# EasyEDA Pro project codeday-badge.eprj, board CodeDay Badge Programmer
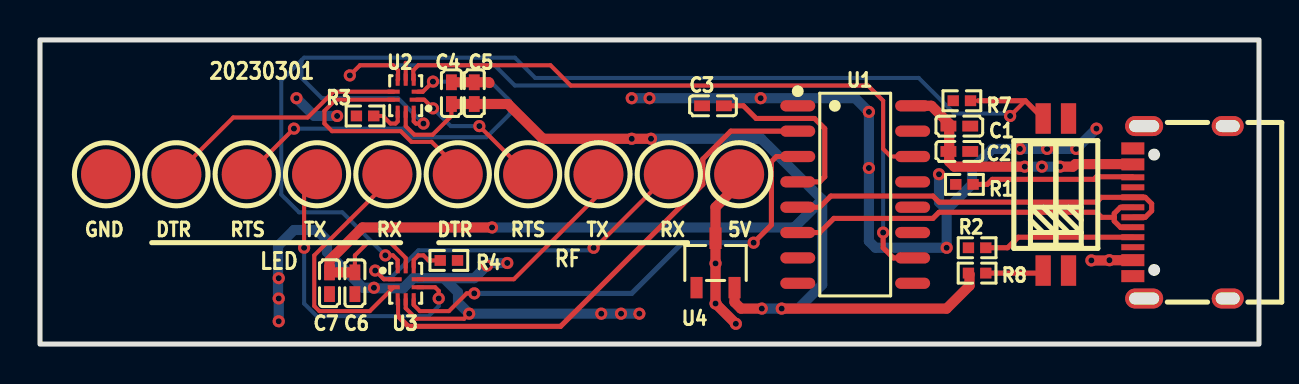
[diagram p6: board, top side]
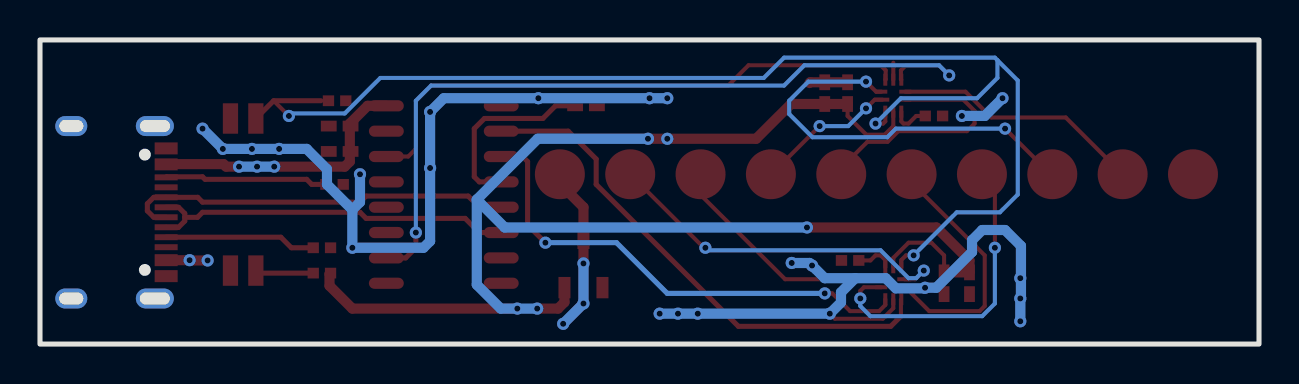
[diagram p7: board, bottom side, seen from below]

Outline 60.96 x 15.24 mm; copper layers: Top Layer, Bottom Layer. Coordinates in mm from the lower left corner of the outline.
Outline path: rectangle 0,15.24 60.96,0
Stack: Top Layer 0.035mm / Dielectric1 1.51mm FR4 er 4.5 / Bottom Layer 0.035mm

## Design rules (mm)
spacing safeClearance (default): track to track 0.152, other pairs 0.152 to 0.3
track width trackWidth (default): min 0.127, default 0.254, max 2.54
track width trackWidthPwr: min 0.127, default 0.508, max 2.54
differential pair differentialPair (default): width min 0.127, default 0.254, max 2.54; gap min 0.152, default 0.152
via viaSize (default): diameter min 0.5, default 0.61, max 10; hole min 0.3, default 0.305, max 6
net +5V uses trackWidthPwr
net VCC uses trackWidthPwr

## Placement (name value [footprint] x y rotation side)
5V  KH-205580-DZ  [SMD_BD2.0-L2.0-W2.0_C9900001905]  34.96 8.51 270 top
C1  10uF  [C0402]  45.97 10.92 180 top
C2  100nF  [C0402_NEW]  45.97 9.65 180 top
C3  10uF  [C0402]  33.65 11.94 180 top
C4  10uF  [C0402]  20.57 12.57 270 top
C5  100nF  [C0402_NEW]  21.72 12.57 270 top
C6  10uF  [C0402]  15.75 3.05 90 top
C7  100nF  [C0402_NEW]  14.48 3.05 90 top
DTR  -  [SMD_BD2.0-L2.0-W2.0_C9900001905]  20.89 8.51 270 top
DTR#2  -  [SMD_BD2.0-L2.0-W2.0_C9900001905]  6.82 8.51 270 top
GND  KH-205580-DZ  [SMD_BD2.0-L2.0-W2.0_C9900001905]  3.3 8.51 270 top
R1  5.1kΩ  [R0402]  46.23 8 180 top
R2  5.1kΩ  [R0402]  46.86 4.83 180 top
R3  5.1kΩ  [R0402]  16.26 11.43 180 top
R4  5.1kΩ  [R0402]  20.45 4.19 0 top
R7  10kΩ  [R0402]  46.1 12.19 180 top
R8  2kΩ  [R0402]  46.86 3.56 180 top
RTS  -  [SMD_BD2.0-L2.0-W2.0_C9900001905]  24.41 8.51 270 top
RTS#2  -  [SMD_BD2.0-L2.0-W2.0_C9900001905]  10.34 8.51 270 top
RX  -  [SMD_BD2.0-L2.0-W2.0_C9900001905]  17.37 8.51 270 top
RX#2  -  [SMD_BD2.0-L2.0-W2.0_C9900001905]  31.44 8.51 270 top
SW1  DSHP02TSGET  [SW-SMD_4P_DSHP02TSGET]  50.8 7.49 0 top
TX  -  [SMD_BD2.0-L2.0-W2.0_C9900001905]  27.93 8.51 270 top
TX#2  -  [SMD_BD2.0-L2.0-W2.0_C9900001905]  13.86 8.51 270 top
U1  CH340C  [SOP-16_L10.0-W3.9-P1.27-LS6.0-BL]  40.77 7.49 270 top
U2  TS3USB30ERSWR  [UQFN-10_L1.8-W1.4-P0.40-TL]  18.29 12.45 180 top
U3  TS3USB30ERSWR  [UQFN-10_L1.8-W1.4-P0.40-TL]  18.29 3.05 0 top
U4  XC6206P332MR  [SOT-23-3_L2.9-W1.6-P1.90-LS2.8-BR]  33.78 4.06 270 top
USB1  GT-USB-7010C  [USB-C-SMD_GT-USB-7010C]  57.02 6.6 90 top

## Footprints (pads in the part's own frame, mm; a bottom-side part is the same pattern mirrored in y, then rotated)
C0402
  rect 0.79x0.54 smd: 1(-0.545,0) 2(0.545,0)
C0402_NEW
  rect 0.79x0.54 smd: 1(-0.545,0) 2(0.545,0)
R0402
  rect 0.566x0.54 smd: 1(-0.433,0) 2(0.433,0)
SMD_BD2.0-L2.0-W2.0_C9900001905
  round 2.5 smd: 1(0,0)
SOP-16_L10.0-W3.9-P1.27-LS6.0-BL
  oval 0.56x1.745 smd: 1(-4.445,-2.873) 2(-3.175,-2.873) 3(-1.905,-2.873) 4(-0.635,-2.873) 5(0.635,-2.873) 6(1.905,-2.873) 7(3.175,-2.873) 8(4.445,-2.873) 9(4.445,2.873) 10(3.175,2.873) 11(1.905,2.873) 12(0.635,2.873) 13(-0.635,2.873) 14(-1.905,2.873) 15(-3.175,2.873) 16(-4.445,2.873)
SOT-23-3_L2.9-W1.6-P1.90-LS2.8-BR
  rect 1.07x0.6 smd: 1(1.235,-0.95) 2(1.235,0.95) 3(-1.235,0)
SW-SMD_4P_DSHP02TSGET
  rect 0.762x1.524 smd: 1(-0.635,-3.81) 2(0.635,-3.81) 3(0.635,3.81) 4(-0.635,3.81)
UQFN-10_L1.8-W1.4-P0.40-TL
  rect 0.7x0.2 smd: 1(-0.55,0.2)
  rect 0.6x0.2 smd: 2(-0.6,-0.2) 6(0.6,-0.2) 7(0.6,0.2)
  rect 0.2x0.6 smd: 3(-0.4,-0.8) 4(0,-0.8) 5(0.4,-0.8) 8(0.4,0.8) 9(0,0.8) 10(-0.4,0.8)
USB-C-SMD_GT-USB-7010C
  oval 1x1.9 hole 0.6x1.5: 1(-4.32,1.808) 2(4.32,1.808)
  oval 1x1.6 hole 0.6x1.2: 3(4.32,-2.373) 4(-4.32,-2.373)
  rect 0.6x1.15 smd: A1B12(-3.2,2.373) A4B9(-2.4,2.373) B1A12(3.2,2.373) B4A9(2.4,2.373)
  rect 0.3x1.15 smd: A5(-1.25,2.373) A6(-0.25,2.373) A7(0.25,2.373) A8(1.25,2.373) B5(1.75,2.373) B6(0.75,2.373) B7(-0.75,2.373) B8(-1.75,2.373)

## Nets
+5V: 5V.1 C1.2 C2.2 U1.16 U4.3 USB1.A4B9 USB1.B4A9
GND: C1.1 C2.1 C3.2 C4.1 C5.1 C6.1 C7.1 GND.1 R1.2 R2.2 R3.2 R4.2 R7.2 U1.1 U2.4 U3.4 U4.1 USB1.1 USB1.2 USB1.3 USB1.4 USB1.A1B12 USB1.B1A12
VCC: C4.2 C5.2 C6.2 C7.2 R8.2 U2.9 U3.9 U4.2
DN: U1.6 USB1.A7 USB1.B7
DP: U1.5 USB1.A6 USB1.B6
DTR: U1.10 U2.5
DTR_LED: DTR#2.1 U2.6
DTR_RF: DTR.1 U2.7
RTS: U1.14 U2.3
RTS_LED: RTS#2.1 U2.2
RTS_RF: RTS.1 U2.1
RX: U1.3 U3.5
RX_LED: RX.1 U3.2
RX_RF: RX#2.1 U3.1
S: R7.1 SW1.4 U2.10 U3.10
TX: U1.2 U3.3
TX_LED: TX#2.1 U3.6
TX_RF: TX.1 U3.7
$1N2326: R1.1 USB1.B5
$1N2338: R2.1 USB1.A5
$1N2857: C3.1 U1.4
$1N5374: R3.1 U2.8
$1N5478: R4.1 U3.8
$1N7631: R8.1 SW1.1

Pads without a net: SW1 2 3; U1 7 8 9 11 12 13 15; USB1 A8 B8

## Via types
v1: diameter 0.61, hole 0.305, Top Layer to Bottom Layer, 51 vias

## Routing (per net, layer and track width the routed paths; a pad name or vN(x,y) marks a point on that pad's centre or on a via; arc(x,y) is an arc through that point)
+5V: length 27.3
  Top Layer w0.508: v1(49.25,8.89) 45.72,8.89 45.47,9.14 45.47,9.61 ; 45.47,10.88 45.43,10.92 ; 45.47,10.88 45.47,11.05 44.58,11.94 U1.16 ; 45.47,10.88 45.47,9.61 ; 34.67,1.14 v1(33.78,2.03) v1(33.78,4.04) U4.3 33.78,6.86 34.96,8.04 5V.1 ; USB1.B4A9 54.64,9.02 51.78,9.02 51.65,8.89 v1(51.01,8.89) ; USB1.A4B9 v1(53.48,4.2) 53.46,4.19 v1(52.58,4.19) ; 45.47,9.61 45.43,9.65
  Bottom Layer w0.508: v1(49.25,8.89) v1(50.11,8.89) v1(51.01,8.89) ; v1(33.78,4.04) v1(33.78,2.03) v1(34.8,1.02)
GND: length 73.7
  Top Layer w0.203: v1(21.46,1.52) 21.21,1.27 18.81,1.27 18.29,1.8 U3.4 ; U2.4 18.29,14.1
  Top Layer w0.508: 22.48,13.08 22.44,13.12 C5.1 C4.1
  Bottom Layer w0.508: 45.34,6.73 44.96,7.11 v1(44.96,8.51) ; 45.34,6.73 v1(45.34,4.83) 41.78,4.83 41.45,5.16 v1(41.45,8.82) v1(41.45,11.63) 40.77,12.32 v1(36.04,12.32) v1(30.48,12.32) v1(29.59,12.32) ; 45.34,6.73 46.61,8 46.61,8.76 47.62,9.78 v1(49,9.78) v1(50.36,9.78) v1(51.82,9.78) v1(52.83,10.8) ; v1(29.97,1.52) v1(29.06,1.52) v1(28.07,1.52) v1(21.46,1.52) 20.9,2.08 20.9,2.59 20.19,3.3 ; 20.19,3.3 18.67,3.3 18.16,2.79 16.73,2.79 v1(16.7,2.82) 16.14,2.82 14.35,4.61 14.35,5.21 13.84,5.71 12.7,5.71 11.9,4.92 11.9,2.32 v1(11.94,2.29) v1(11.94,1.14) ; 20.19,3.3 21.72,3.3 v1(22.35,3.94) 22.48,4.06 v1(23.37,4.06) ; v1(12.83,12.32) 13.72,11.43 v1(14.86,11.43)
  vias: v1(11.94,3.3)
VCC: length 77.4
  Top Layer w0.203: C6.2 15.75,4.44 16.38,5.08 17.53,5.08 18.29,4.32 U3.9 ; C4.2 20.57,11.43 19.63,10.49 18.72,10.49 18.29,10.92 U2.9
  Top Layer w0.508: v1(36.1,1.78) 35.05,1.78 34.73,2.1 U4.2 ; v1(37.09,1.78) 45.34,1.78 46.48,2.92 46.48,3.5 R8.2 ; C6.2 C7.2 14.48,4.19 16.13,5.84 v1(22.61,5.84) ; C4.2 C5.2 23.4,12.03 25.15,10.29 v1(29.59,10.29) v1(30.56,10.29)
  Bottom Layer w0.508: v1(36.1,1.78) v1(37.09,1.78) 37.92,1.78 39.12,2.98 39.12,7.24 ; 39.12,7.24 37.72,5.84 v1(22.61,5.84) ; 39.12,7.24 36.07,10.29 v1(30.56,10.29)
DN: length 18.9
  Top Layer w0.254: U1.6 38.99,5.59 39.7,6.3 44.65,6.3 44.96,6.6 52.83,6.6 53.09,6.35 53.72,6.35 ; 53.72,6.35 53.72,6.16 54.04,5.84 54.64,5.84 USB1.B7 ; 53.72,6.35 53.72,6.54 54.03,6.85 USB1.A7
DP: length 19.7
  Top Layer w0.254: USB1.A6 55.27,6.35 55.59,6.67 55.59,7.03 55.27,7.35 USB1.B6 53.07,7.35 52.83,7.11 44.96,7.11 44.65,7.42 39.55,7.42 38.99,6.86 U1.5
DTR: length 39.9
  Top Layer w0.203: U2.5 17.91,13.27 17.91,13.72 17.65,13.97 16,13.97 v1(15.49,13.46)
  Top Layer w0.254: v1(42.16,5.59) 42.16,4.83 42.67,4.32 U1.10
  Bottom Layer w0.203: v1(42.16,5.59) 42.16,12.19 41.4,12.95 23.75,12.95 22.73,13.97 16,13.97 v1(15.49,13.46)
DTR_LED: length 12.6
  Top Layer w0.203: U2.6 14.68,12.65 13.39,11.35 9.67,11.35 DTR#2.1
DTR_RF: length 12.2
  Top Layer w0.203: DTR.1 20.89,8.83 19.58,10.13 18.57,10.13 18.04,10.67 14.61,10.67 14.22,11.05 14.22,11.68 14.79,12.25 U2.7
RTS: length 28.9
  Top Layer w0.203: U1.14 42.55,9.4 42.16,9.78 42.16,12.19 41.4,12.95 26.54,12.95 25.53,13.97 18.92,13.97 18.67,13.72 18.67,13.27 U2.3
RTS_LED: length 20.6
  Top Layer w0.203: v1(19.65,13.15) 19.15,12.65 U2.2 ; RTS#2.1 10.41,8.51 v1(12.7,10.8)
  Bottom Layer w0.203: v1(19.65,13.15) 22.54,13.15 23.49,12.19 23.49,11.53 22.33,10.36 18.59,10.36 18.16,10.8 v1(12.7,10.8)
RTS_RF: length 7.1
  Top Layer w0.203: v1(19.65,11.81) 19.22,12.25 U2.1 ; v1(21.97,10.92) 24.38,8.51 RTS.1
  Bottom Layer w0.203: v1(21.97,10.92) 20.54,10.92 v1(19.65,11.81)
RX: length 24.7
  Top Layer w0.203: v1(21.72,2.54) 21.34,2.54 20.45,1.65 19,1.65 18.69,1.96 U3.5
  Top Layer w0.254: U1.3 36.83,9.4 36.58,9.14 36.58,5.97 v1(35.69,5.08)
  Bottom Layer w0.254: v1(21.72,2.54) 29.59,2.54 32.13,5.08 v1(35.69,5.08)
RX_LED: length 12.7
  Top Layer w0.203: RX.1 17.37,8.1 13.72,4.44 13.72,1.91 13.97,1.65 16.49,1.65 U3.2
RX_RF: length 18.1
  Top Layer w0.203: v1(16.76,3.68) 17.2,3.25 U3.1 ; RX#2.1 27.76,4.83 v1(27.69,4.83)
  Bottom Layer w0.203: v1(16.76,3.68) 17.14,3.3 17.53,3.3 18.92,4.7 27.56,4.7 v1(27.69,4.83)
S: length 65
  Top Layer w0.203: U3.10 17.89,4.21 17.65,4.44 v1(17.27,4.44) ; v1(19.18,11.05) 18.8,11.05 18.69,11.16 U2.10 ; v1(48.51,11.43) 49.28,12.19
  Top Layer w0.254: 46.92,12.19 49.28,12.19 SW1.4
  Bottom Layer w0.203: v1(48.51,11.43) 48.39,11.56 45.72,11.56 43.94,13.33 24.77,13.33 23.75,14.35 13.21,14.35 13.08,14.22 ; 13.08,14.22 13.08,13.33 14.1,12.32 17.91,12.32 v1(19.18,11.05) ; 13.08,14.22 12.06,13.21 12.06,7.49 12.95,6.6 15.11,6.6 v1(17.27,4.44)
TX: length 25.8
  Top Layer w0.203: 17.91,1.4 17.91,2.23
  Top Layer w0.254: 17.91,1.4 18.42,0.89 26.03,0.89 33.15,8 33.15,9.27 34.54,10.67 U1.2
TX_LED: length 15.8
  Top Layer w0.203: U3.6 19.76,2.85 19.94,2.67 v1(19.94,2.29) ; TX#2.1 13.21,7.86 v1(13.21,4.83)
  Bottom Layer w0.203: v1(19.94,2.29) 19.94,1.91 19.43,1.4 13.84,1.4 13.21,2.03 v1(13.21,4.83)
TX_RF: length 11.8
  Top Layer w0.203: U3.7 23.69,3.25 27.93,7.48 TX.1
$1N2326: length 8.2
  Top Layer w0.254: USB1.B5 54.62,8.38 52.83,8.38 52.7,8.25 47.62,8.25 47.37,8 R1.1
$1N2338: length 7.6
  Top Layer w0.254: R2.1 48.39,4.83 48.92,5.35 USB1.A5
$1N2857: length 9.4
  Top Layer w0.254: U1.4 38.99,8.13 39.24,8.38 39.24,10.8 38.73,11.3 35.81,11.3 35.18,11.94 C3.1
$1N5374: length 1.9
  Top Layer w0.203: U2.8 17.89,11.16 17.78,11.05 17.53,11.05 17.14,11.43 R3.1
$1N5478: length 1.9
  Top Layer w0.203: U3.8 18.69,4.21 18.92,4.44 19.18,4.44 19.43,4.19 R4.1
$1N7631: length 2.9
  Top Layer w0.254: R8.1 50.04,3.56 SW1.1

## Copper pours and planes (outline as drawn; the poured copper is in the pictures)
+5V on Bottom Layer: 0.32,14.73 60.39,14.73 60.39,0.51 0.32,0.51
GND on Top Layer: 0.38,14.73 60.45,14.73 60.45,0.51 0.38,0.51

## Text on the board
Top Silkscreen Layer: 20230301 | LED | RF
